# EAGLE design coffee_maker (EAGLE 6.4)
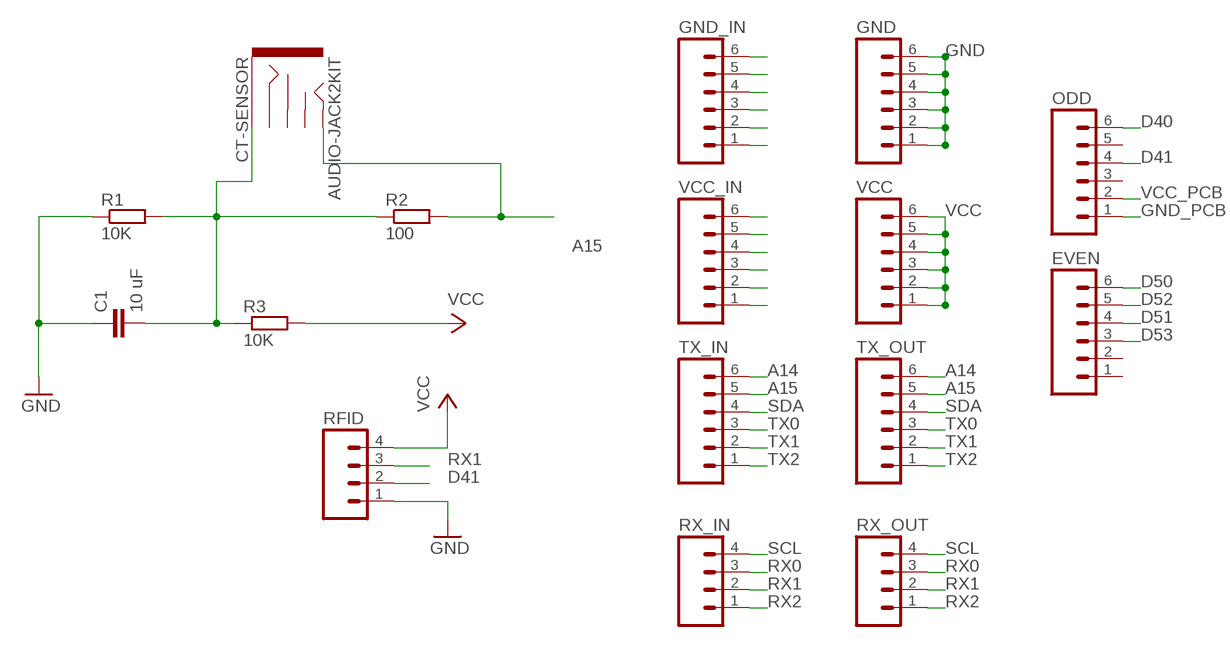
[diagram p0: schematic, sheet 1]

## Parts
C1  10 uF  C-EUC1206  [C1206]
CT-SENSOR  AUDIO-JACK2KIT  [AUDIO-JACK-KIT]
EVEN  M06SIP  [1X06]
GND  M06SIP  [1X06]
GND_IN  M06SIP  [1X06]
ODD  M06SIP  [1X06]
R1  10K  R-EU_M1206  [M1206]
R2  100  R-EU_M1206  [M1206]
R3  10K  R-EU_M1206  [M1206]
RFID  M04SMD2  [1X04-1MM-RA]
RX_IN  M04PTH  [1X04]
RX_OUT  M04PTH  [1X04]
TX_IN  M06SIP  [1X06]
TX_OUT  M06SIP  [1X06]
VCC  M06SIP  [1X06]
VCC_IN  M06SIP  [1X06]

## Nets
A14: TX_IN.6 TX_OUT.6
A15: CT-SENSOR.TIP R2.2 TX_IN.5 TX_OUT.5
D40: ODD.6
D41: ODD.4 RFID.2
D50: EVEN.6
D51: EVEN.4
D52: EVEN.5
D53: EVEN.3
GND: C1.1 GND.1 GND.2 GND.3 GND.4 GND.5 GND.6 GND_IN.6 R1.1 RFID.1
GND_PCB: ODD.1
N$1: C1.2 CT-SENSOR.SLEEVE R1.2 R2.1 R3.1
N$2: VCC_IN.6
N$3: VCC_IN.5
N$4: VCC_IN.4
N$5: VCC_IN.3
N$8: GND_IN.5
N$9: GND_IN.4
N$10: GND_IN.3
N$11: GND_IN.1
N$17: VCC_IN.2
N$73: GND_IN.2
RX0: RX_IN.3 RX_OUT.3
RX1: RFID.3 RX_IN.2 RX_OUT.2
RX2: RX_IN.1 RX_OUT.1
SCL: RX_IN.4 RX_OUT.4
SDA: TX_IN.4 TX_OUT.4
TX0: TX_IN.3 TX_OUT.3
TX1: TX_IN.2 TX_OUT.2
TX2: TX_IN.1 TX_OUT.1
VCC: R3.2 RFID.4 VCC.1 VCC.2 VCC.3 VCC.4 VCC.5 VCC.6 VCC_IN.1
VCC_PCB: ODD.2
Unconnected: CT-SENSOR.RING CT-SENSOR.RSH CT-SENSOR.TSH EVEN.1 EVEN.2 ODD.3 ODD.5

## Library data of the parts
C1 = resistor:C-EU: CAPACITOR, European symbol
CT-SENSOR = SparkFun-Connectors:AUDIO-JACK2: Stereo audio jack with bypass switches. SMT version used on LilyPad MP3 board.; PROD_ID: CONN-08774
EVEN GND GND_IN ODD TX_IN TX_OUT VCC VCC_IN = SparkFun-Connectors:M06: Header 6 Standard 6-pin 0.1" header. Use with straight break away headers (SKU : PRT-00116), right angle break away headers (PRT-00553), swiss pins (PRT-00743), machine pins (PRT-00117), and female headers (PRT-00115). Molex polarized connector foot print use with SKU : PRT-08094 with associated crimp pins and housings. NOTES ON THE VARIANTS LOCK and LOCK_LONGPADS... This footprint was designed to help hold the alignment of a through-hole component (i.e. 6-pin header) while soldering it into place. You may notice that each hole has been shifted either up or down by 0.005 of an inch from it's more standard position (which is a perfectly straight line). This slight alteration caused the pins (the squares in the middle) to touch the edges of the holes. Because they are alternating, it causes a "brace" to hold the component in place. 0.005 has proven to be the perfect amount of "off-center" position when using our standard breakaway headers. Although looks a little odd when you look at the bare footprint, once you have a header in there, the alteration is very hard to notice. Also,if you push a header all the way into place, it is covered up entirely on the bottom side. This idea of altering the position of holes to aid alignment will be further integrated into the Sparkfun Library for other footprints. It can help hold any component with 3 or more connection pins.
R1-R3 = resistor:R-EU_: RESISTOR, European symbol
RFID RX_IN RX_OUT = SparkFun-Connectors:M04: Header 4 Standard 4-pin 0.1" header. Use with straight break away headers (SKU : PRT-00116), right angle break away headers (PRT-00553), swiss pins (PRT-00743), machine pins (PRT-00117), and female headers (PRT-00115). Molex polarized connector foot print use with SKU : PRT-08231 with associated crimp pins and housings. 1MM SMD Version SKU: PRT-10208

## Board
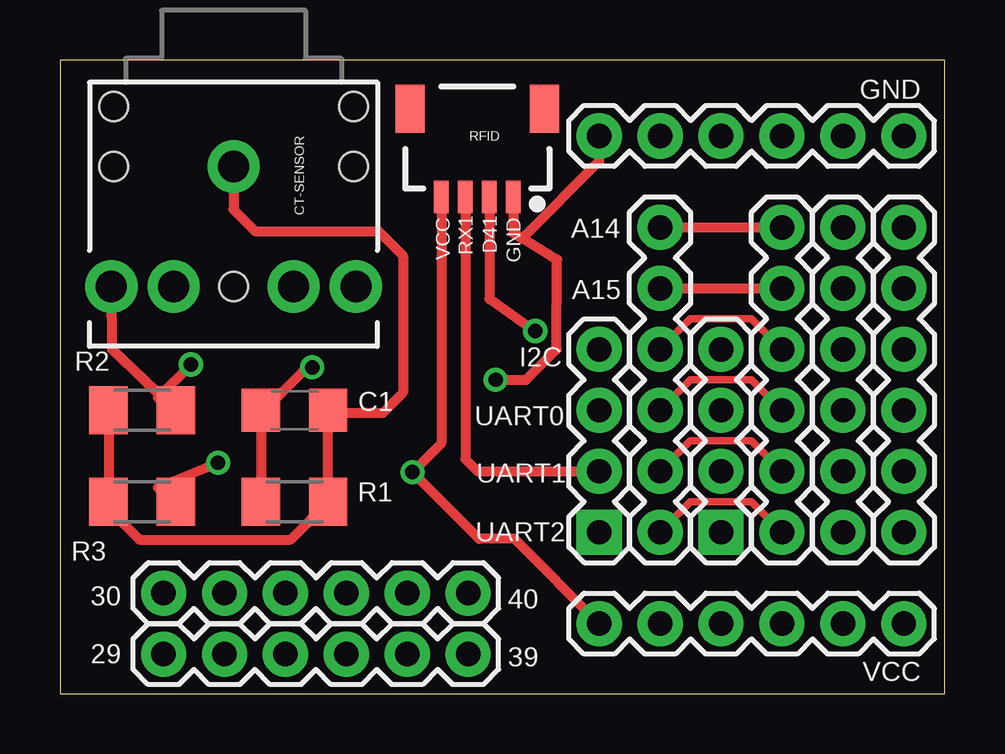
[diagram p1: board, top side]
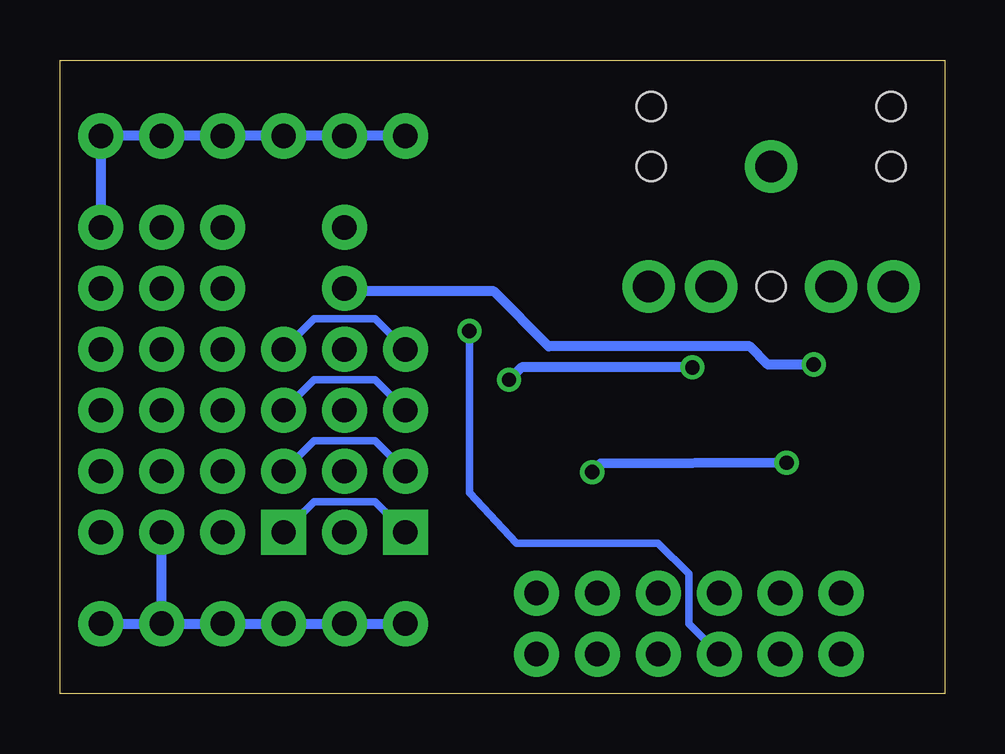
[diagram p2: board, bottom side, seen from below]

Size 36.88 x 26.41 mm. Coordinates in mm from the lower left corner, seen from the top.
Outline: 0,0 36.88,0 36.88,26.41 0,26.41 0,0
Copper layers (1*16): Top 0.035mm / dielectric 1.5mm / Bottom 0.035mm
Design rules "default": minimum track width 10mil, minimum drill 24mil, track to track 8mil, track to pad 8mil, pad to pad 8mil, via to via 8mil, smd to smd 8mil, copper to edge 40mil, drill to drill 8mil, minimum pad ring 10mil, minimum via ring 8mil, stop-mask expansion 4mil, vias tented up to drill 0mil, thermal gap 10mil

### Footprints (pad centres in the part's own frame; a part is rotated, then mirrored left to right if it is on the bottom)
C1206 = smd 1.6 x 1.8: 1 -1.4,0; 2 1.4,0
AUDIO-JACK-KIT = drill 1.3 pad 2.184: RING 5,5.1; RSH 5,2.5; SLEEVE 0,0; TIP 5,-5.1; TSH 5,-2.5 | hole 1.2: 0,5; -2.5,5; -2.5,-5; 0,-5; 5,0
1X06 = drill 1.016 pad 1.88: 1 0,0; 2 2.54,0; 3 5.08,0; 4 7.62,0; 5 10.16,0; 6 12.7,0
M1206 = smd 1.6 x 2: 1 -1.4,0; 2 1.4,0
1X04-1MM-RA = smd 0.6 x 1.35: 1 -1.5,0; 2 -0.5,0; 3 0.5,0; 4 1.5,0 | smd 1.2 x 2: NC1 2.8,-3.675; NC2 -2.8,-3.675
1X04 = drill 1.016 pad 1.88 square: 1 0,0 | drill 1.016 pad 1.88: 2 2.54,0; 3 5.08,0; 4 7.62,0

### Placement (x,y rotation side)
C1  9.78,11.81 0 top
CT-SENSOR  7.24,21.97 270 top
EVEN  17.02,4.19 180 top
GND  35.18,23.24 180 top
GND_IN  35.18,6.73 90 top
ODD  17.02,1.65 180 top
R1  9.78,8 0 top
R2  3.43,11.81 0 top
R3  3.43,8 0 top
RFID  17.4,20.7 180 top
RX_IN  27.56,6.73 90 top
RX_OUT  22.48,6.73 90 top
TX_IN  30.1,6.73 90 top
TX_OUT  25.02,6.73 90 top
VCC  35.18,2.92 180 top
VCC_IN  32.64,6.73 90 top

### Tracks (layer width: path | path; a pad name or v marks a point on that pad's centre or on a via)
A14
  Top 0.406: TX_OUT.6 TX_IN.6
A15  (via drill 0.6)
  Top 0.406: CT-SENSOR.TIP 2.16,14.35 R2.2 4.08,12.33 v5.46,13.72 | TX_OUT.5 TX_IN.5
  Bottom 0.406: v5.46,13.72 7.37,13.72 8.13,14.48 16.51,14.48 18.8,16.76 24.89,16.76 TX_OUT.5
D41  (via drill 0.6)
  Top 0.406: RFID.2 17.9,16.45 v19.81,15.11
  Bottom 0.305: v19.81,15.11 19.81,8.38 17.86,6.27 11.95,6.27 10.67,4.99 10.67,2.92 ODD.4
GND  (via drill 0.6)
  Top 0.406: R1.1 C1.1 9.13,12.43 10.3,13.6 v10.52,13.6 | RFID.1 18.9,19.2 19.27,18.97 | 19.27,18.97 20.73,18.09 20.7,14.35 19.43,13.08 v18.16,13.08 | GND.6 22.48,22.18 19.27,18.97
  Bottom 0.406: GND.6 GND.5 GND.4 GND.3 GND.2 GND.1 GND_IN.6 | v10.52,13.6 17.64,13.6 v18.16,13.08
N$1
  Top 0.406: R2.1 R3.1 2.03,7.71 3.32,6.43 9.6,6.43 R1.2 C1.2 11.29,11.7 13.45,11.7 14.3,12.55 14.3,18.25 13.27,19.28 8.13,19.28 7.24,20.17 CT-SENSOR.SLEEVE
RX0
  Bottom 0.305: RX_OUT.3 23.75,13.08 26.29,13.08 RX_IN.3
RX1
  Top 0.406: RFID.3 16.9,9.77 17.4,9.27 RX_OUT.2
  Bottom 0.305: RX_OUT.2 23.75,10.54 26.29,10.54 RX_IN.2
RX2
  Bottom 0.305: RX_OUT.1 23.75,8 26.29,8 RX_IN.1
SCL
  Bottom 0.305: RX_OUT.4 23.75,15.62 26.29,15.62 RX_IN.4
SDA
  Top 0.305: TX_OUT.4 26.29,15.62 28.83,15.62 TX_IN.4
TX0
  Top 0.305: TX_OUT.3 26.29,13.08 28.83,13.08 TX_IN.3
TX1
  Top 0.305: TX_OUT.2 26.29,10.54 28.83,10.54 TX_IN.2
TX2
  Top 0.305: TX_OUT.1 26.29,8 28.83,8 TX_IN.1
VCC  (via drill 0.6)
  Top 0.406: RFID.4 15.9,10.44 v14.69,9.23 17.47,6.45 18.95,6.45 VCC.6 | R3.2 4.08,8.59 v6.59,9.63
  Bottom 0.406: VCC.1 VCC.2 | VCC.2 VCC.3 VCC.4 VCC.5 VCC.6 | VCC.2 VCC_IN.1 | v6.59,9.63 14.34,9.59 v14.69,9.23

### Text on the board
tNames: A14 | VCC | RX1 | D41 | GND | A15 | I2C | UART0 | UART1 | UART2 | 30 | 40 | 29 | 39